# EAGLE design stm32 (EAGLE 9.6.2)
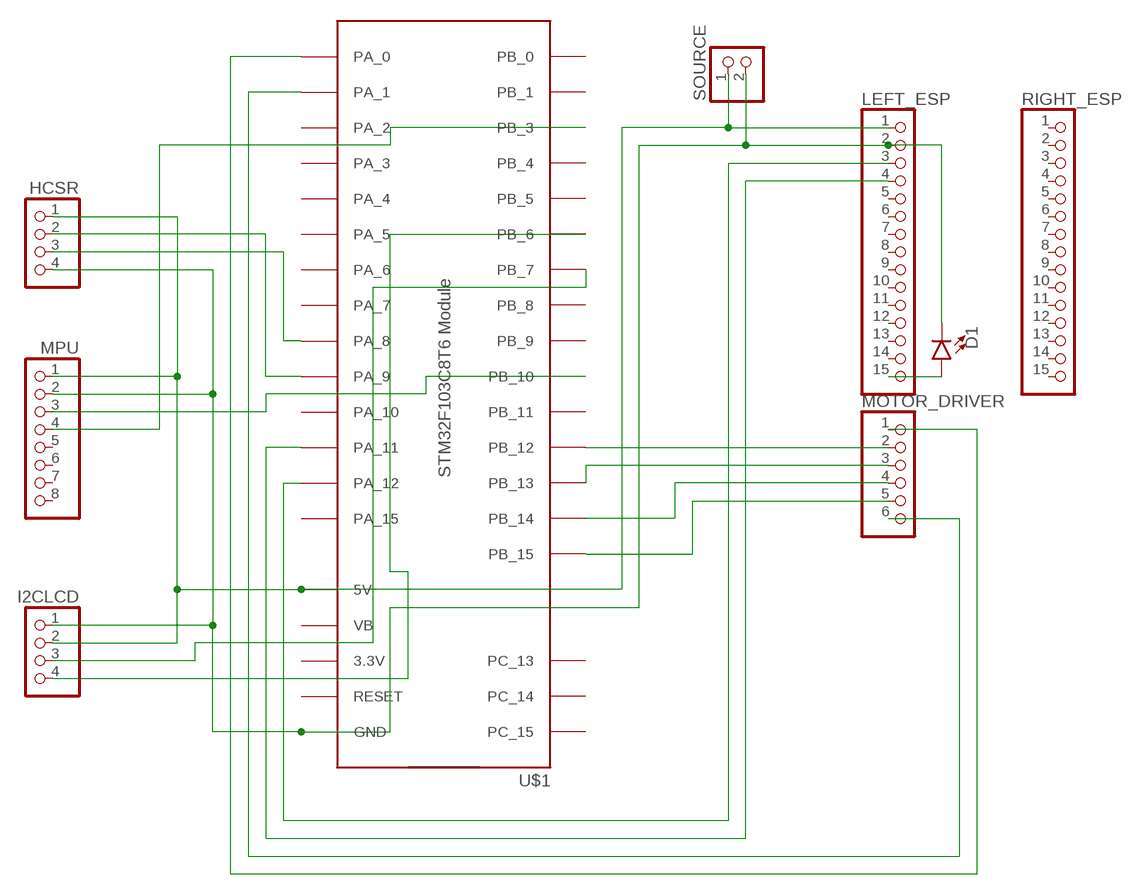
[diagram p0: schematic, sheet 1]

## Parts
D1  LED-3MM-NO_SILK  [LED_3MM-NS]
HCSR  PINHD-1X4  [1X04]
I2CLCD  PINHD-1X4  [1X04]
LEFT_ESP  PINHD-1X15  [1X15]
MOTOR_DRIVER  PINHD-1X6  [1X06]
MPU  PINHD-1X8  [1X08]
RIGHT_ESP  PINHD-1X15  [1X15]
SOURCE  PINHD-1X2  [1X02]
U$1  STM32F103C8T6-MODULE  [STM32F103C8T6-MODULE]

## Nets
N$1: HCSR.1 I2CLCD.2 LEFT_ESP.1 MPU.1 SOURCE.1 U$1.5V
N$2: LEFT_ESP.3 U$1.PA_12
N$3: LEFT_ESP.4 U$1.PA_11
N$4: MOTOR_DRIVER.1 U$1.PA_0
N$5: MOTOR_DRIVER.6 U$1.PA_1
N$6: MOTOR_DRIVER.3 U$1.PB_13
N$7: D1.A LEFT_ESP.15
N$8: D1.K(C) HCSR.4 I2CLCD.1 LEFT_ESP.2 MPU.2 SOURCE.2 U$1.GND@1(GND) U$1.GND@2(GND) U$1.GND@3(GND)
N$9: MOTOR_DRIVER.2 U$1.PB_12
N$10: MOTOR_DRIVER.4 U$1.PB_14
N$11: MOTOR_DRIVER.5 U$1.PB_15
N$14: I2CLCD.3 U$1.PB_7
N$15: I2CLCD.4 U$1.PB_6
N$17: MPU.3 U$1.PB_10
N$18: MPU.4 U$1.PB_3
N$20: HCSR.2 U$1.PA_9
N$21: HCSR.3 U$1.PA_8
Unconnected: LEFT_ESP.5 LEFT_ESP.6 LEFT_ESP.7 LEFT_ESP.8 LEFT_ESP.9 LEFT_ESP.10 LEFT_ESP.11 LEFT_ESP.12 LEFT_ESP.13 LEFT_ESP.14 MPU.5 MPU.6 MPU.7 MPU.8 RIGHT_ESP.1 RIGHT_ESP.2 RIGHT_ESP.3 RIGHT_ESP.4 RIGHT_ESP.5 RIGHT_ESP.6 RIGHT_ESP.7 RIGHT_ESP.8 RIGHT_ESP.9 RIGHT_ESP.10 RIGHT_ESP.11 RIGHT_ESP.12 RIGHT_ESP.13 RIGHT_ESP.14 RIGHT_ESP.15 U$1.3.3V@1(3.3V) U$1.3.3V@2(3.3V) U$1.PA_2 U$1.PA_3 U$1.PA_4 U$1.PA_5 U$1.PA_6 U$1.PA_7 U$1.PA_10 U$1.PA_15 U$1.PB_0 U$1.PB_1 U$1.PB_4 U$1.PB_5 U$1.PB_8 U$1.PB_9 U$1.PB_11 U$1.PC_13 U$1.PC_14 U$1.PC_15 U$1.RESET U$1.VB

## Library data of the parts
D1 = SparkFun-LED:LED: LED (Generic) Standard schematic elements and footprints for 5mm, 3mm, 1206, and 0603 sized LEDs. Generic LEDs with no color specified.
HCSR I2CLCD = pinhead:PINHD-1X4: PIN HEADER
LEFT_ESP RIGHT_ESP = pinhead:PINHD-1X15: PIN HEADER
MOTOR_DRIVER = pinhead:PINHD-1X6: PIN HEADER
MPU = pinhead:PINHD-1X8: PIN HEADER
SOURCE = pinhead:PINHD-1X2: PIN HEADER
U$1 = bluepill_eagle_lib:STM32F103C8T6-MODULE: STM32F103C8T6 module with ARM Cortex-3, 20kB SRAM, 64kB Flash, 72MHz

## Board
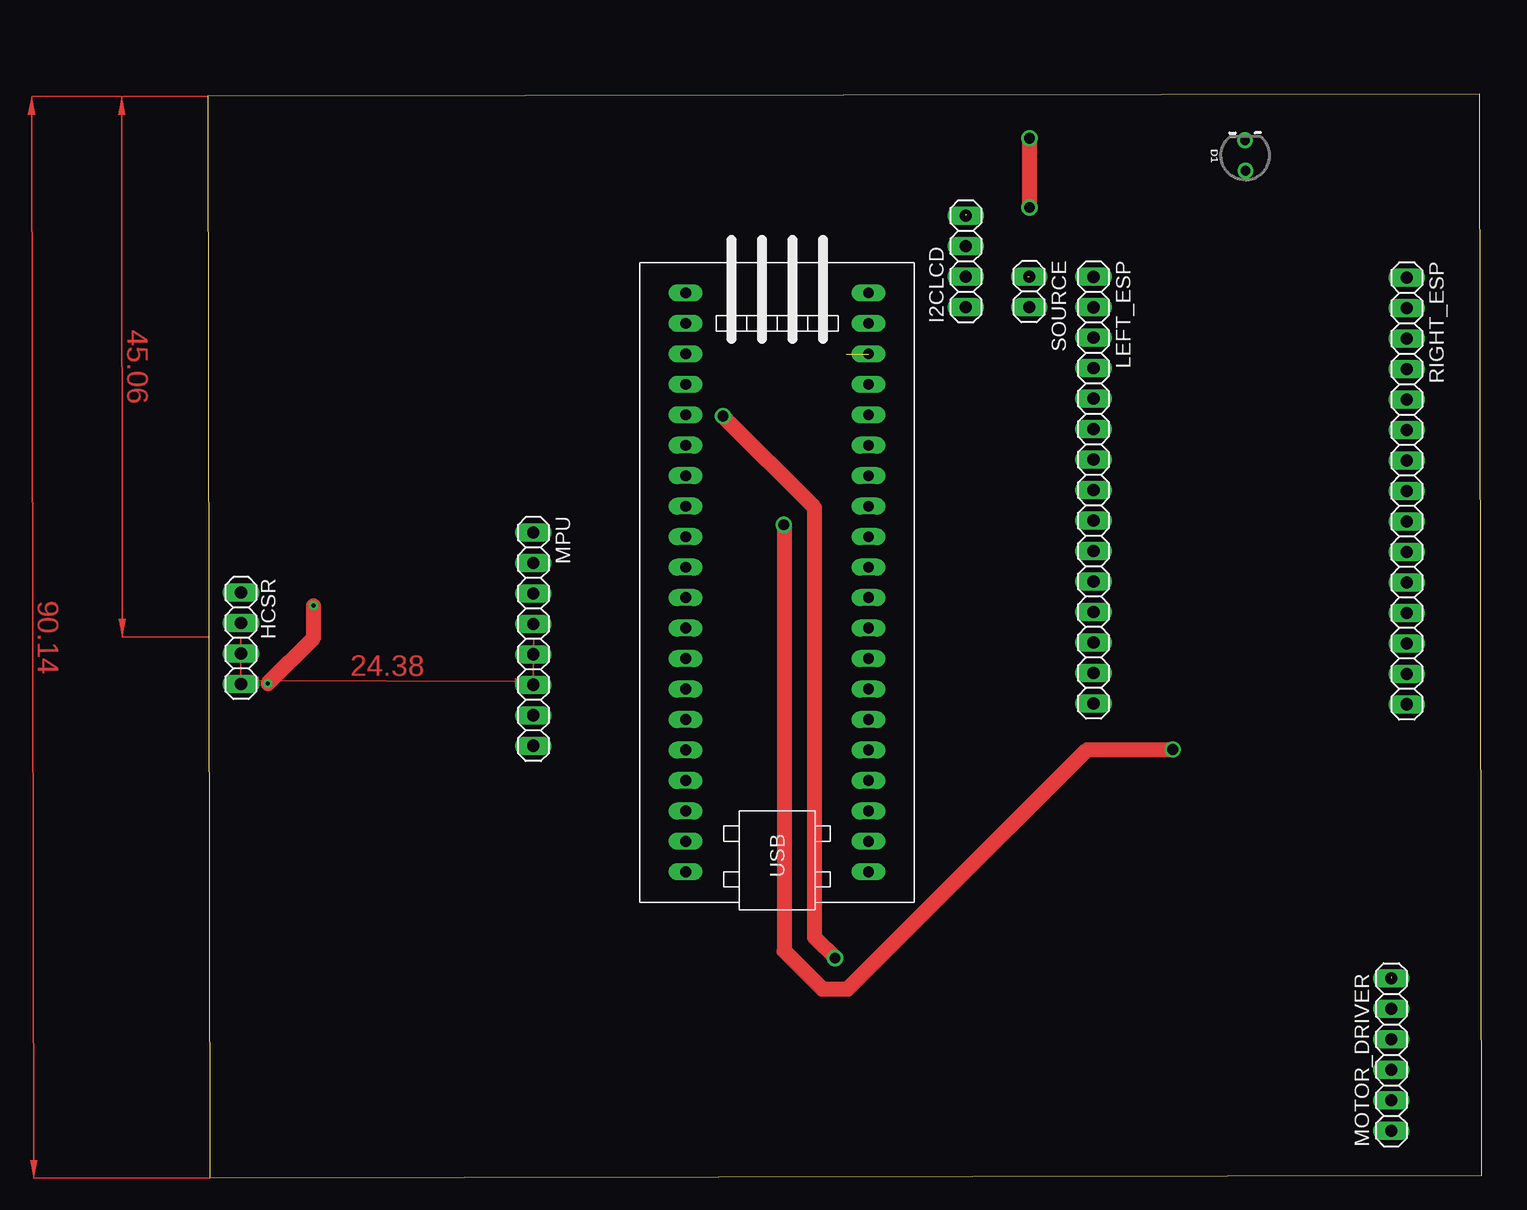
[diagram p1: board, top side]
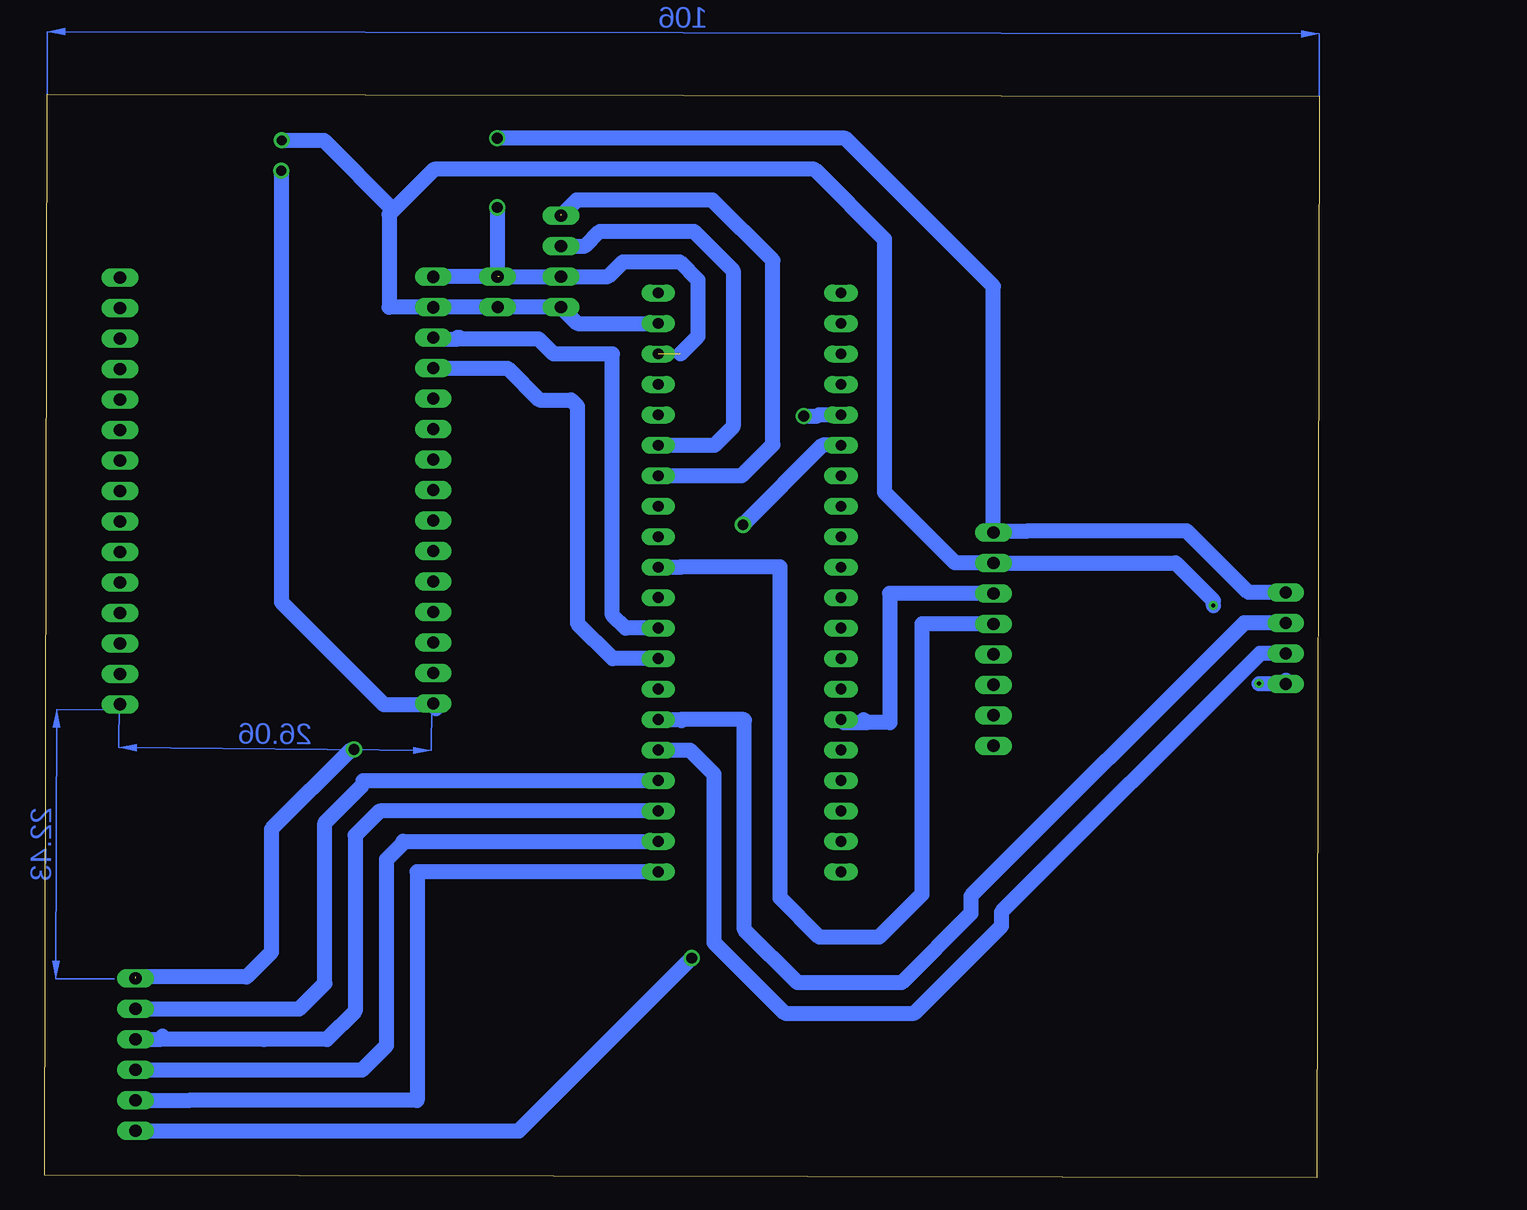
[diagram p2: board, bottom side, seen from below]

Size 106.18 x 90.35 mm. Coordinates in mm from the lower left corner, seen from the top.
Outline: 0.18,0 106.18,0.2 106,90.35 0,90.15 0.18,0
Copper layers (1*16): Top 0.035mm / dielectric 1.5mm / Bottom 0.035mm
Design rules "default *": minimum track width 50mil, minimum drill 0.35mm, track to track 50mil, track to pad 50mil, pad to pad 6mil, via to via 6mil, smd to smd 6mil, copper to edge 40mil, drill to drill 6mil, minimum pad ring 10mil, minimum via ring 8mil, stop-mask expansion 4mil, vias tented up to drill 0mil, thermal gap 10mil

### Footprints (pad centres in the part's own frame; a part is rotated, then mirrored left to right if it is on the bottom)
LED_3MM-NS = drill 0.813: A -1.27,0; K 1.27,0
1X04 = drill 1.016 long: 1 -3.81,0; 2 -1.27,0; 3 1.27,0; 4 3.81,0
1X15 = drill 1.016 long: 1 -17.78,0; 2 -15.24,0; 3 -12.7,0; 4 -10.16,0; 5 -7.62,0; 6 -5.08,0; 7 -2.54,0; 8 0,0; 9 2.54,0; 10 5.08,0; 11 7.62,0; 12 10.16,0; 13 12.7,0; 14 15.24,0; 15 17.78,0
1X06 = drill 1.016 long: 1 -6.35,0; 2 -3.81,0; 3 -1.27,0; 4 1.27,0; 5 3.81,0; 6 6.35,0
1X08 = drill 1.016 long: 1 -8.89,0; 2 -6.35,0; 3 -3.81,0; 4 -1.27,0; 5 1.27,0; 6 3.81,0; 7 6.35,0; 8 8.89,0
1X02 = drill 1.016 long: 1 -1.27,0; 2 1.27,0
STM32F103C8T6-MODULE = drill 0.9 long: 3.3V@1 25.4,-7.62; 3.3V@2 -17.78,7.62; 5V 20.32,-7.62; GND@1 22.86,-7.62; GND@2 -20.32,7.62; GND@3 -22.86,7.62; PA_0 15.24,7.62; PA_1 12.7,7.62; PA_2 10.16,7.62; PA_3 7.62,7.62; PA_4 5.08,7.62; PA_5 2.54,7.62; PA_6 0,7.62; PA_7 -2.54,7.62; PA_8 -12.7,-7.62; PA_9 -10.16,-7.62; PA_10 -7.62,-7.62; PA_11 -5.08,-7.62; PA_12 -2.54,-7.62; PA_15 0,-7.62; PB_0 -5.08,7.62; PB_1 -7.62,7.62; PB_3 2.54,-7.62; PB_4 5.08,-7.62; PB_5 7.62,-7.62; PB_6 10.16,-7.62; PB_7 12.7,-7.62; PB_8 15.24,-7.62; PB_9 17.78,-7.62; PB_10 -10.16,7.62; PB_11 -12.7,7.62; PB_12 -22.86,-7.62; PB_13 -20.32,-7.62; PB_14 -17.78,-7.62; PB_15 -15.24,-7.62; PC_13 22.86,7.62; PC_14 20.32,7.62; PC_15 17.78,7.62; RESET -15.24,7.62; VB 25.4,7.62

### Placement (x,y rotation side)
D1  86.46,85.22 90.8 top
HCSR  2.77,44.98 270 top
I2CLCD  63.17,76.4 90 top
LEFT_ESP  73.81,57.33 270 top
MOTOR_DRIVER  98.63,10.26 90 top
MPU  27.13,44.91 270 top
RIGHT_ESP  99.92,57.25 270 top
SOURCE  68.45,73.86 269.9 top
U$1  47.45,48.36 90 top

### Tracks (layer width: path | path; a pad name or v marks a point on that pad's centre or on a via)
N$1  (via drill 0.9)  (2 unrouted)
  Top 1.27: v68.48,86.65 v68.48,80.9
  Bottom 1.27: LEFT_ESP.1 73.79,75.13 SOURCE.1 I2CLCD.2 | I2CLCD.2 | I2CLCD.2 59.23,75.13 58,76.37 53.28,76.37 51.75,74.84 51.75,70.14 53.21,68.68 | v68.48,86.65 39.46,86.65 27.13,74.32 27.13,53.92 27,53.92 | v68.48,80.9 68.48,75.28 68.33,75.13 | HCSR.1 5.89,48.79 11.02,53.92 24.23,53.92 27,53.92 | MPU.1 27,53.92
N$2
  Bottom 1.27: U$1.PA_12 57.81,45.82 58.88,46.89 58.88,68.68 63.79,68.68 65.04,69.93 67.72,69.93 67.72,69.92 71.71,69.92 | 71.71,69.92 71.82,70.03 71.79,70.05 71.65,70.05 | LEFT_ESP.3 73.71,69.92 71.71,69.92
N$3
  Bottom 1.27: LEFT_ESP.4 67.61,67.49 64.97,64.85 62.33,64.85 61.8,64.31 61.8,46.22 58.86,43.28 U$1.PA_11
N$4  (via drill 0.9)
  Top 1.27: v52.27,18.31 50.57,20.02 50.57,55.87 v42.94,63.5
  Bottom 1.27: MOTOR_DRIVER.1 66.68,3.91 v52.27,18.31 | v42.94,63.5 41.78,63.5 41.68,63.6 U$1.PA_0
N$5  (via drill 0.9)  (1 unrouted)
  Top 1.27: v48.01,54.43 48.03,54.41 48.03,18.91 51.2,15.73 53.34,15.73 73.31,35.7 v80.42,35.7
  Bottom 1.27: U$1.PA_1 41.38,61.06 v48.01,54.43 | v80.42,35.7 80.46,35.66 80.71,35.66 87.3,29.07 87.3,18.8 89.36,16.74 98.63,16.74
N$6
  Bottom 1.27: U$1.PB_13 76.33,28.04 76.33,27.93 77.7,26.55 77.7,11.02 79.73,8.99 MOTOR_DRIVER.3
N$7
  Bottom 1.27: D1.A 86.48,48 77.9,39.42 73.94,39.42 | 73.94,39.42 73.81,39.42 73.58,39.19 73.58,39.09 | LEFT_ESP.15 73.94,39.42
N$8  (via drill 0.35)
  Top 1.27: v5,41.2 8.81,45.01 v8.81,47.7
  Bottom 1.27: U$1.GND@1 61.8,71.22 I2CLCD.1 SOURCE.2 73.79,72.59 LEFT_ESP.2 77.5,72.57 77.5,80.32 77.13,80.68 | 2.77,41.48 HCSR.4 4.98,41.17 v5,41.2 | 77.13,80.68 73.74,84.07 42.04,84.07 36.22,78.26 36.22,57.15 30.33,51.26 MPU.2 11.95,51.26 8.81,48.12 v8.81,47.7 | D1.K 82.93,86.49 77.13,80.68
N$9
  Bottom 1.27: U$1.PB_12 75.16,25.5 75.16,6.45 94.21,6.45 95.83,6.45 MOTOR_DRIVER.2
N$10
  Bottom 1.27: U$1.PB_14 78.28,30.58 80.31,28.55 80.31,13.89 82.68,11.53 87.93,11.53 96.63,11.53 | 97.33,11.53 MOTOR_DRIVER.4 96.63,11.53 | 96.37,11.79 96.63,11.53
N$11
  Bottom 1.27: U$1.PB_15 79.65,33.12 79.65,32.8 82.85,29.6 82.85,16.2 84.99,14.07 MOTOR_DRIVER.5 98.63,14.15
N$14
  Bottom 1.27: I2CLCD.3 61.16,77.67 59.93,78.91 52.09,78.91 48.82,75.64 48.82,62.61 50.37,61.06 U$1.PB_7
N$15  (1 unrouted)
  Bottom 1.27: U$1.PB_6 48.11,58.52 45.52,61.11 45.52,76.48 50.55,81.51 61.87,81.51 63.04,80.34 63.17,80.34
N$17
  Bottom 1.27: MPU.3 35.79,48.72 35.79,38 35.74,37.95 37.72,37.95 | 37.72,37.95 37.97,38.2 | U$1.PB_10 39.57,37.95 37.72,37.95
N$18
  Bottom 1.27: MPU.4 33.1,46.18 33.1,23.62 36.68,20.04 41.63,20.04 44.91,23.32 44.91,50.93 53.19,50.93 53.21,50.9 U$1.PB_3
N$20
  Bottom 1.27: 53.21,38.2 47.93,38.2 47.88,38.15 47.88,20.68 43.46,16.26 34.77,16.26 29.01,22.02 29.01,23.49 6.25,46.25 HCSR.2 | 53.21,38.2 53.11,38.1 | U$1.PA_9 53.21,38.2
N$21
  Bottom 1.27: U$1.PA_8 52.43,35.66 50.42,33.66 50.42,19.62 44.51,13.72 33.72,13.72 26.47,20.97 26.47,22.15 4.9,43.71 HCSR.3
(copper drawn outside any net)
  shapes: Bottom area x3, Top area x3